# EAGLE design hello bord (EAGLE 9.6.2)
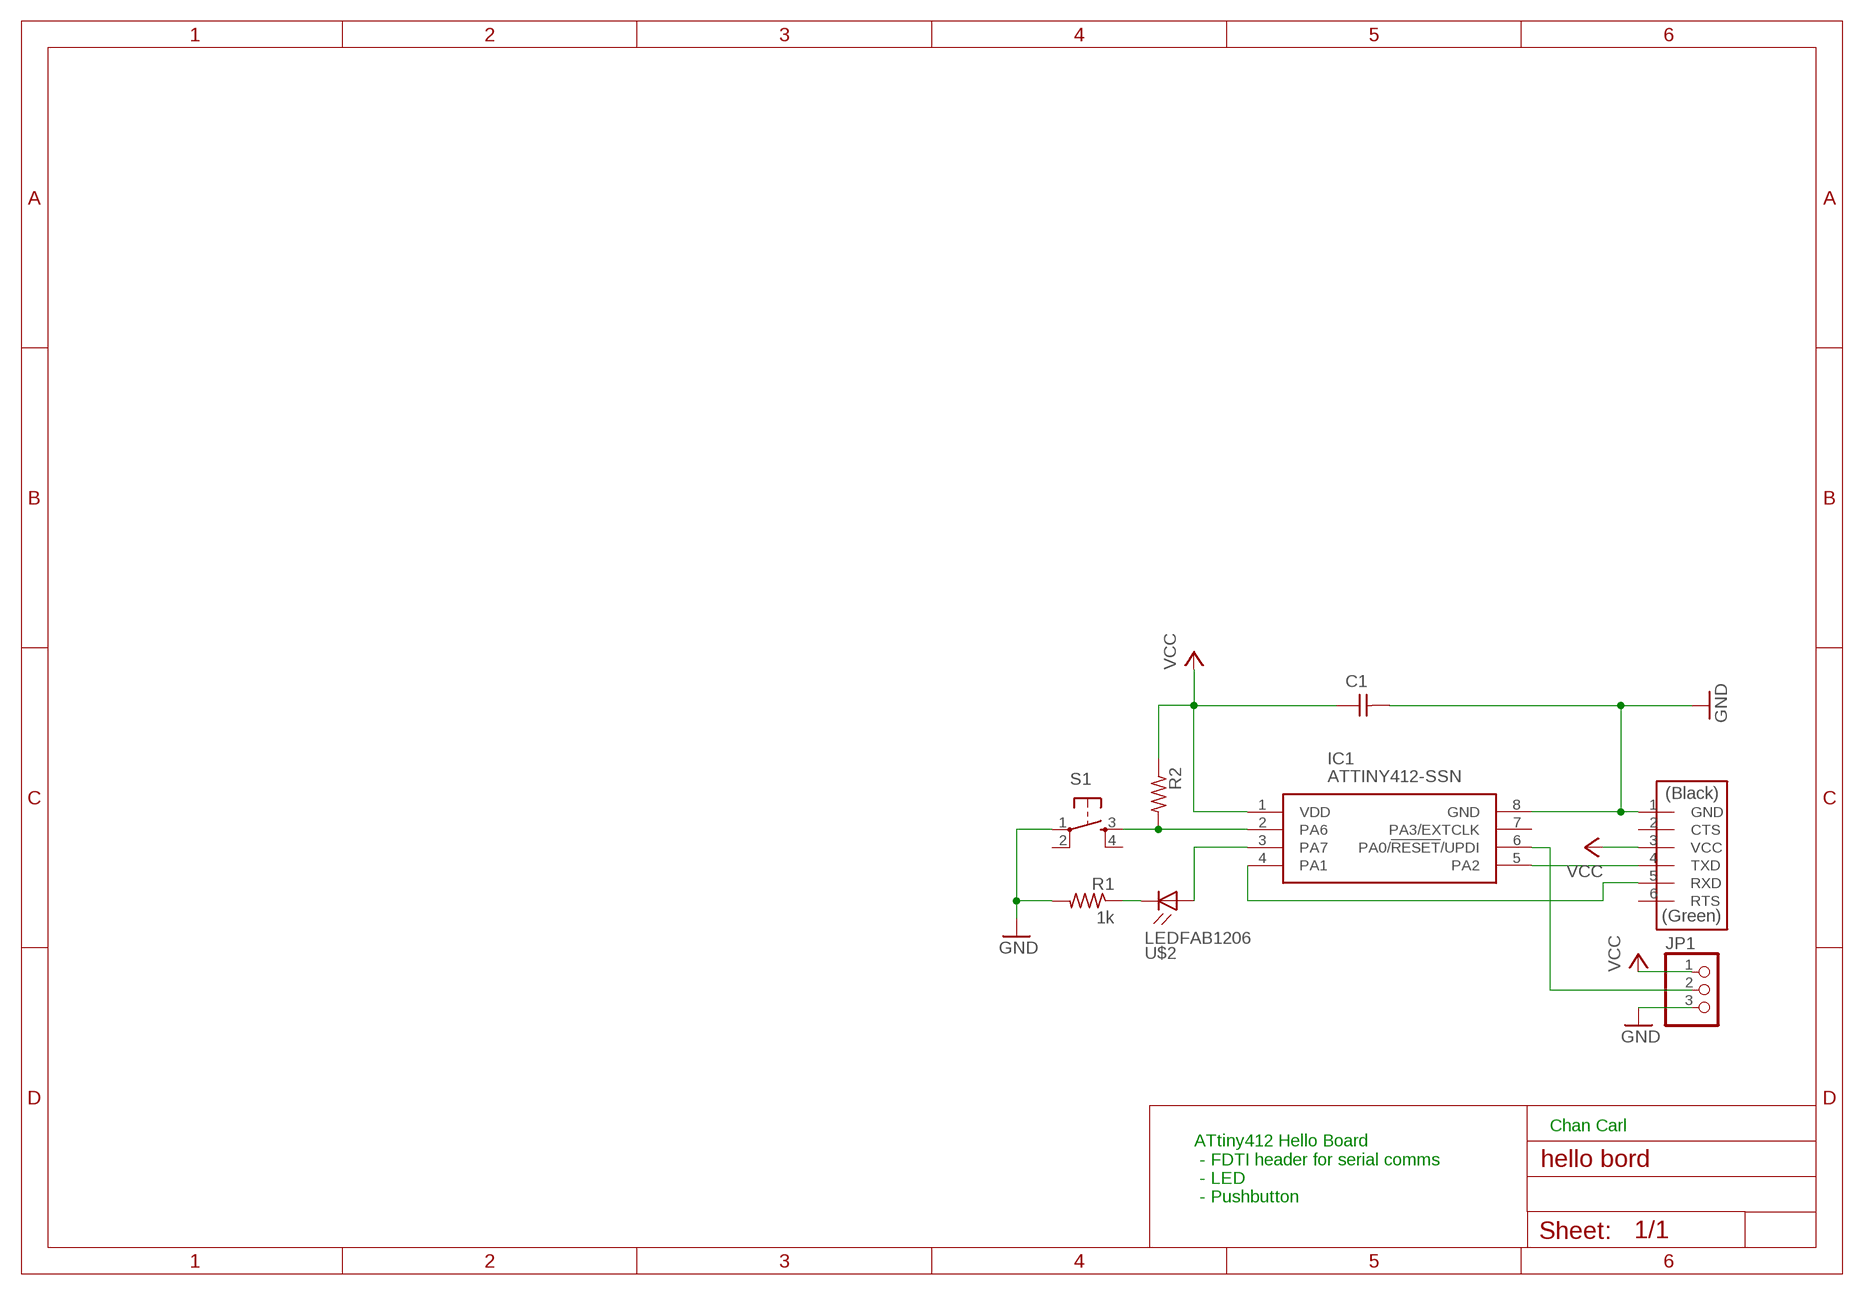
[diagram p0: schematic, sheet 1]

## Parts
C1  CAP_UNPOLARIZED  [C1206]
IC1  ATTINY412-SSN  [SOIC127P600X175-8N]
JP1  PINHD-1X3  [1X03]
R1  1k  R1206  [R1206]
R2  R1206  [R1206]
S1  SW_SWITCH_TACTILE_6MM6MM_SWITCH  [6MM_SWITCH]
U$1  CONN_06_FTDI-SMD-HEADER  [1X06SMD]
U$2  LEDFAB1206  [LED1206FAB]

## Nets
GND: C1.2 IC1.8(GND) JP1.3 R1.2 S1.1(P) U$1.1(GND)
N$1: IC1.6(PA0/!RESET!/UPDI) JP1.2
N$2: IC1.3(PA7) U$2.1(A)
N$3: R1.1 U$2.2(C)
N$4: IC1.5(PA2) U$1.4(TXD)
N$5: IC1.4(PA1) U$1.5(RXD)
N$6: IC1.2(PA6) R2.2 S1.3(S)
VCC: C1.1 IC1.1(VDD) JP1.1 R2.1 U$1.3(VCC)
Unconnected: IC1.7(PA3/EXTCLK) S1.2(P1) S1.4(S1) U$1.2(CTS) U$1.6(RTS)

## Notes on the sheet
- Chan Carl
- ATtiny412 Hello Board
   - FDTI header for serial comms
   - LED
   - Pushbutton

## Library data of the parts
C1 = fab:CAP_UNPOLARIZED
IC1 = ATTINY412-SSN:ATTINY412-SSN: 8-bit Microcontrollers - MCU 20MHz, 4KB, SOIC8, Ind 105C, Green, Tube Source: Datasheet <http://www.microchip.com/mymicrochip/filehandler.aspx?ddocname=en599382>; DESCRIPTION: 8-bit Microcontrollers - MCU 20MHz, 4KB, SOIC8, Ind 105C, Green, Tube; HEIGHT: 1.75mm; MANUFACTURER_NAME: Microchip; MANUFACTURER_PART_NUMBER: ATTINY412-SSN; MOUSER_PART_NUMBER: 579-ATTINY412-SSN; MOUSER_PRICE-STOCK: https://www.mouser.co.uk/ProductDetail/Microchip-Technology/ATTINY412-SSN?qs=3HJ2avRr9PItQG9ZsCamPQ%3D%3D
JP1 = pinhead:PINHD-1X3: PIN HEADER
R1 R2 = fab:R: Resistor (US Symbol) Variants with postfix FAB are widened to allow the routing of internal traces
S1 = fab:SW_SWITCH_TACTILE_6MM: OMRON SWITCH
U$1 = fab:CONN_06_FTDI-SMD-HEADER
U$2 = fab:LED: LED

## Board
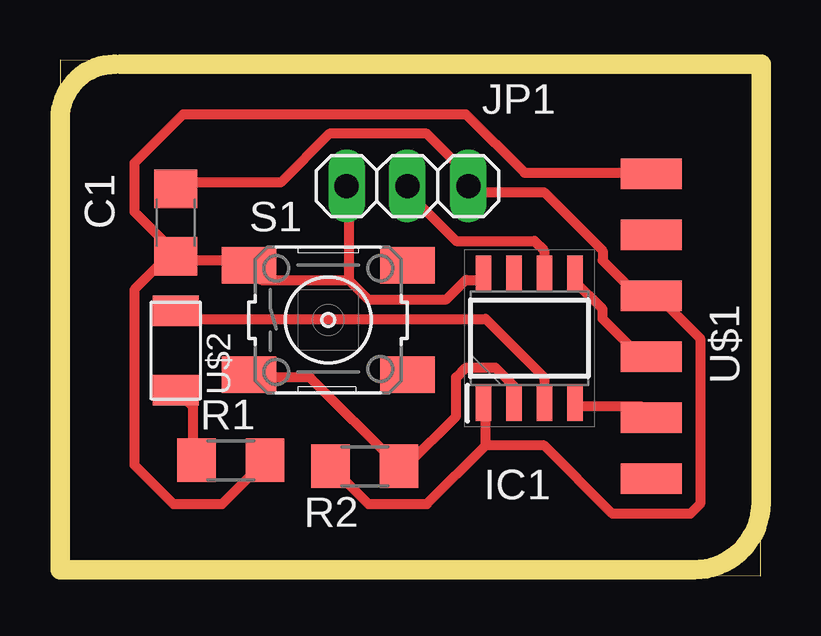
[diagram p1: board, top side]

Size 29.19 x 21.51 mm. Coordinates in mm from the lower left corner, seen from the top.
Outline: 0,0.25 29.19,0 29.19,21.26 0,21.51 0,0.25
Copper layers (1*16): Top 0.035mm / dielectric 1.5mm / Bottom 0.035mm
Design rules "default *": minimum track width 16mil, minimum drill 0.35mm, track to track 16mil, track to pad 16mil, pad to pad 16mil, via to via 16mil, smd to smd 16mil, copper to edge 40mil, drill to drill 6mil, minimum pad ring 10mil, minimum via ring 8mil, stop-mask expansion 4mil, vias tented up to drill 0mil, thermal gap 10mil
Milling: 8 lines

### Footprints (pad centres in the part's own frame; a part is rotated, then mirrored left to right if it is on the bottom)
C1206 = smd 1.6 x 1.8: 1 -1.4,0; 2 1.4,0
SOIC127P600X175-8N = smd 1.5 x 0.65: 1 -2.7,1.905; 2 -2.7,0.635; 3 -2.7,-0.635; 4 -2.7,-1.905; 5 2.7,-1.905; 6 2.7,-0.635; 7 2.7,0.635; 8 2.7,1.905
1X03 = drill 1.016 long: 1 -2.54,0; 2 0,0; 3 2.54,0
R1206 = smd 1.6 x 1.803: 1 -1.422,0; 2 1.422,0
6MM_SWITCH = smd 2.286 x 1.524: 1 -3.302,2.286; 2 3.302,2.286; 3 -3.302,-2.286; 4 3.302,-2.286
1X06SMD = smd 2.54 x 1.27: 1 0,6.35; 2 0,3.81; 3 0,1.27; 4 0,-1.27; 5 0,-3.81; 6 0,-6.35
LED1206FAB = smd 1.27 x 1.905: 1 -1.651,0; 2 1.651,0

### Placement (x,y rotation side)
C1  4.83,14.73 270 top
IC1  19.56,9.91 90 top
JP1  14.48,16.26 180 top
R1  7.11,4.83 0 top
R2  12.7,4.57 0 top
S1  11.18,10.67 0 top
U$1  24.64,10.41 0 top
U$2  4.83,9.4 270 top

### Tracks (layer width: path | path; a pad name or v marks a point on that pad's centre or on a via)
GND
  Top 0.406: 12.04,12.34 12.85,11.53 16.1,11.53 16.92,12.34 17.73,12.34 IC1.8 | 12.04,12.34 12.04,16 JP1.3 | 4.72,13.56 3.1,11.94 3.1,4.62 4.72,3 6.76,3 8.38,4.62 R1.2 | 4.72,13.56 3.1,15.19 3.1,17.22 5.13,19.25 16.92,19.25 19.36,16.82 24.64,16.82 U$1.1 | 4.72,13.56 C1.2 5.13,13.16 7.57,13.16 S1.1 7.98,12.75 8.38,12.34 12.04,12.34
N$1
  Top 0.406: IC1.6 20.17,12.75 20.17,13.56 19.76,13.97 16.51,13.97 14.48,16 JP1.2
N$2
  Top 0.406: IC1.3 20.17,7.47 20.17,8.28 17.73,10.72 5.13,10.72 U$2.1
N$3
  Top 0.406: R1.1 5.54,5.03 5.54,7.06 5.13,7.47 U$2.2
N$4
  Top 0.406: IC1.5 21.39,12.34 22.61,11.12 22.61,10.72 23.82,9.5 24.64,9.5 U$1.4
N$5
  Top 0.406: IC1.4 21.39,7.06 24.23,7.06 24.64,6.65 U$1.5
N$6
  Top 0.406: IC1.2 18.95,7.47 18.95,7.87 18.14,8.69 16.92,8.69 16.51,8.28 16.51,6.65 14.48,4.62 R2.2 14.07,4.62 10.41,8.28 7.98,8.28 S1.3
VCC
  Top 0.406: 17.73,5.44 17.73,7.06 IC1.1 | 17.73,5.44 15.29,3 12.85,3 11.63,4.22 R2.1 | C1.1 5.13,16.41 9.2,16.41 11.23,18.44 15.29,18.44 17.32,16.41 JP1.1 17.32,16 20.17,16 22.61,13.56 22.61,13.16 23.82,11.94 24.64,11.94 | 17.73,5.44 20.17,5.44 23.01,2.59 26.26,2.59 26.67,3 26.67,9.91 24.64,11.94 | 24.64,11.94 U$1.3